# EasyEDA Pro project ProProject_扫描隧道显微镜OpenSTM_2023-08-25.epro, schematic ScannerMount
Create Date: 2022-08-19; Page Name: P1; Project Name: STM-New-Structure; Schematic Name: Schematic2; Update Date: 2022-08-19; Add into BOM: yes; Convert to PCB: yes
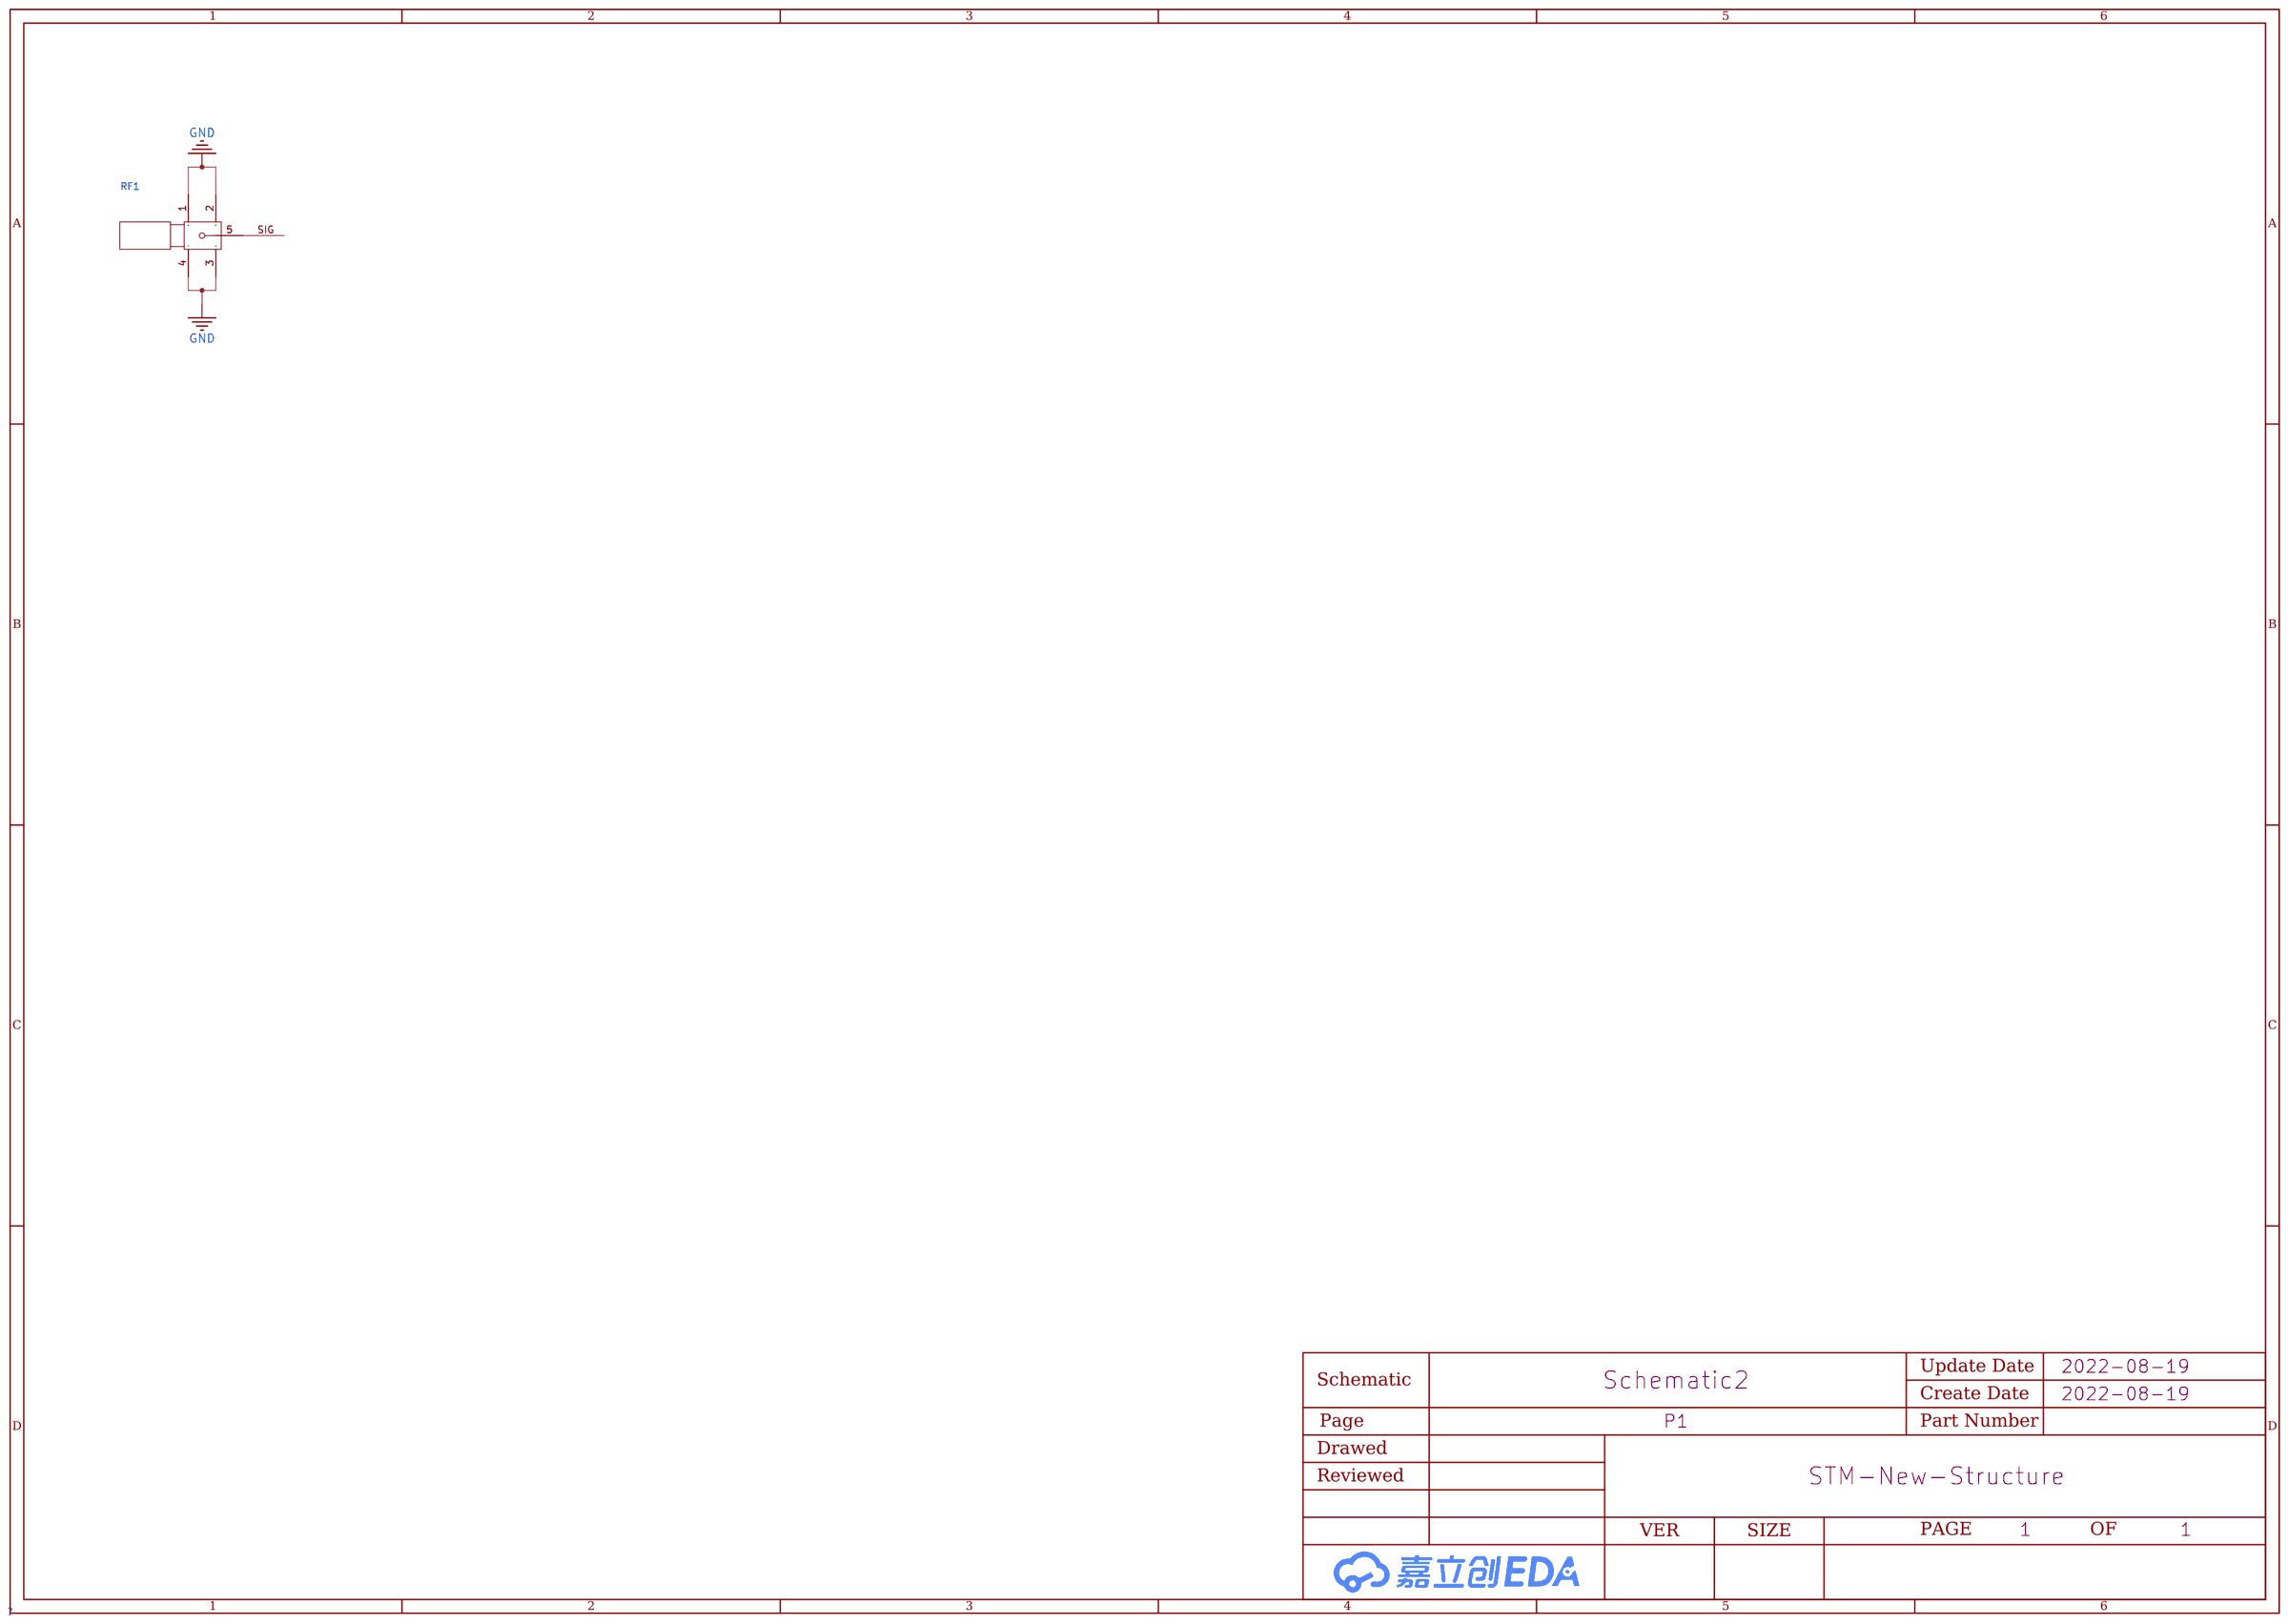
[diagram p7: schematic sheet]

## Parts
RF1  -  [ANT-SMD_KH-MMCX-KE-STM]

## Library data of the parts
RF1 = KH-MMCX-KE-STM: 连接器类型:板端;射频系列:MCX/MMCX;接口类型:内孔;端口数量:1;阻抗:50Ω;频率-最大值:6GHz;样式:正脚;接口直径:-;接口长度/高度:-;工作温度范围:-40~+125;; LCSC Part Name: MCX/MMCX内孔正脚; Supplier Part: C2898970; Manufacturer: kinghelm(金航标); JLCPCB Part Class: ExtendedPart; Datasheet: https://atta.szlcsc.com/upload/public/pdf/source/20210927/807EFBEB8C37EC98B86880AECB5A769C.pdf; Supplier: LCSC; Connector Type: 板端; RF Series: MCX/MMCX; Interface Type: 内孔; Number of Ports: 1; Impedance: 50Ω; Frequency-Max: 6GHz; Style: 正脚; Operating Temperature Range: -40~+125

## Nets
GND: RF1.1 RF1.2 RF1.3 RF1.4
SIG: RF1.5
